# EAGLE design Kenbak-nanoduino_v2_001 (EAGLE 9.3.0)
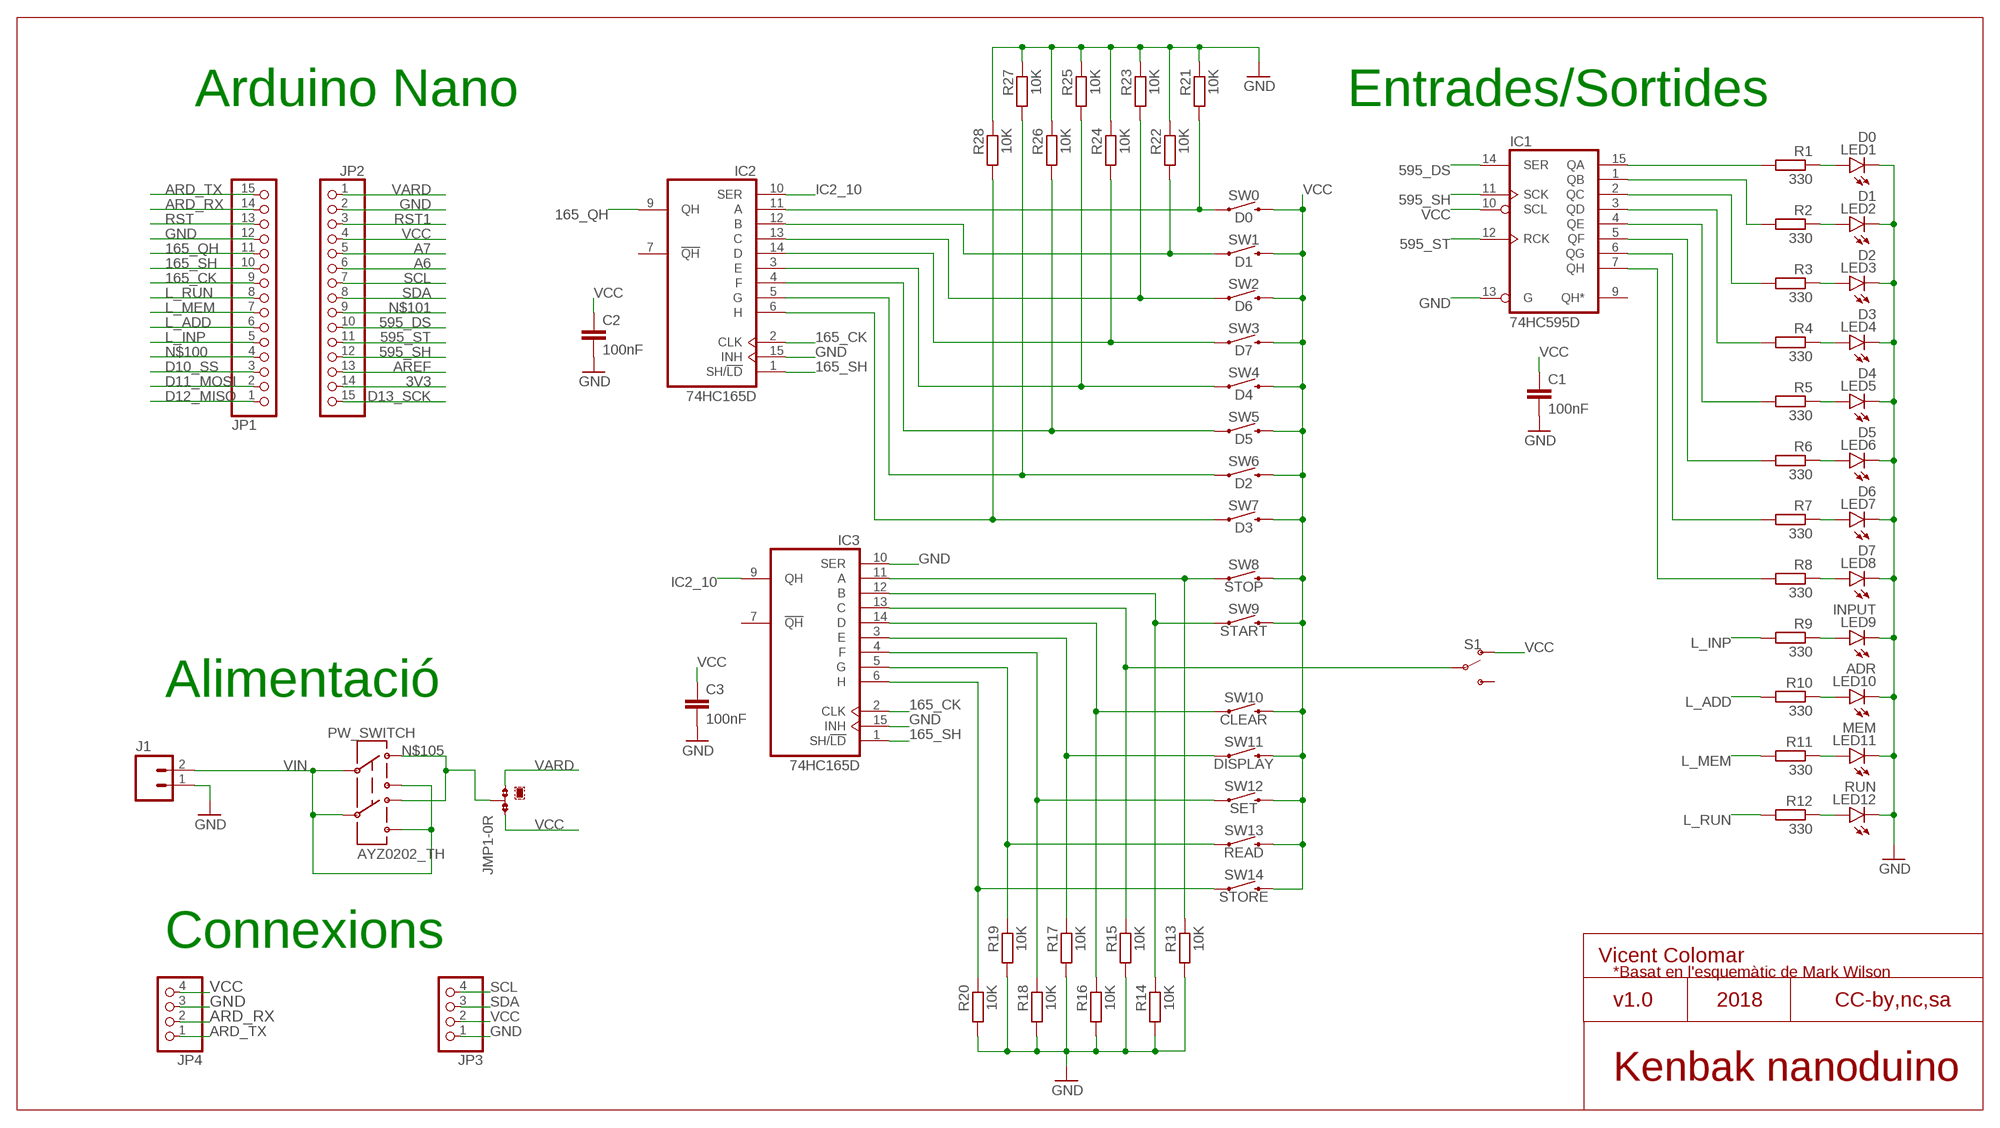
[diagram p0: schematic, sheet 1]

## Parts
C1  100nF  C-EUC1206  [C1206]
C2  100nF  C-EUC1206  [C1206]
C3  100nF  C-EUC1206  [C1206]
IC1  74HC595D  [SO16]
IC2  74HC165D  [SO16]
IC3  74HC165D  [SO16]
J1  M02LOCK_LONGPADS  [1X02_LOCK_LONGPADS]
JMP1  0R-JUMPA  [A0R-JMP]
JP1  PINHD-1X15_2.54-SMD  [1X15SMD]
JP2  PINHD-1X15_2.54-SMD  [1X15SMD]
JP3  PINHD-1X04_2.54-SMD  [1X04SMD]
JP4  PINHD-1X04_2.54-SMD  [1X04SMD]
LED1  D0  LED3MM  [LED3MM]
LED2  D1  LED3MM  [LED3MM]
LED3  D2  LED3MM  [LED3MM]
LED4  D3  LED3MM  [LED3MM]
LED5  D4  LED3MM  [LED3MM]
LED6  D5  LED3MM  [LED3MM]
LED7  D6  LED3MM  [LED3MM]
LED8  D7  LED3MM  [LED3MM]
LED9  INPUT  LED3MM  [LED3MM]
LED10  ADR  LED3MM  [LED3MM]
LED11  MEM  LED3MM  [LED3MM]
LED12  RUN  LED3MM  [LED3MM]
PW_SWITCH  AYZ0202_TH  [AYZ0202_TH]
R1  330  R-EU_R1206  [R1206]
R2  330  R-EU_R1206  [R1206]
R3  330  R-EU_R1206  [R1206]
R4  330  R-EU_R1206  [R1206]
R5  330  R-EU_R1206  [R1206]
R6  330  R-EU_R1206  [R1206]
R7  330  R-EU_R1206  [R1206]
R8  330  R-EU_R1206  [R1206]
R9  330  R-EU_R1206  [R1206]
R10  330  R-EU_R1206  [R1206]
R11  330  R-EU_R1206  [R1206]
R12  330  R-EU_R1206  [R1206]
R13  10K  R-EU_R1206  [R1206]
R14  10K  R-EU_R1206  [R1206]
R15  10K  R-EU_R1206  [R1206]
R16  10K  R-EU_R1206  [R1206]
R17  10K  R-EU_R1206  [R1206]
R18  10K  R-EU_R1206  [R1206]
R19  10K  R-EU_R1206  [R1206]
R20  10K  R-EU_R1206  [R1206]
R21  10K  R-EU_R1206  [R1206]
R22  10K  R-EU_R1206  [R1206]
R23  10K  R-EU_R1206  [R1206]
R24  10K  R-EU_R1206  [R1206]
R25  10K  R-EU_R1206  [R1206]
R26  10K  R-EU_R1206  [R1206]
R27  10K  R-EU_R1206  [R1206]
R28  10K  R-EU_R1206  [R1206]
S1  SWITCH-SPDT-PTH-11.6X4.0MM  [SWITCH_SPDT_PTH_11.6X4.0MM]
SW0  D0  BOTOSMD  [TACTILE_SWITCH_SMD_6.0X3.5MM]
SW1  D1  BOTOSMD  [TACTILE_SWITCH_SMD_6.0X3.5MM]
SW2  D6  BOTOSMD  [TACTILE_SWITCH_SMD_6.0X3.5MM]
SW3  D7  BOTOSMD  [TACTILE_SWITCH_SMD_6.0X3.5MM]
SW4  D4  BOTOSMD  [TACTILE_SWITCH_SMD_6.0X3.5MM]
SW5  D5  BOTOSMD  [TACTILE_SWITCH_SMD_6.0X3.5MM]
SW6  D2  BOTOSMD  [TACTILE_SWITCH_SMD_6.0X3.5MM]
SW7  D3  BOTOSMD  [TACTILE_SWITCH_SMD_6.0X3.5MM]
SW8  STOP  BOTOSMD  [TACTILE_SWITCH_SMD_6.0X3.5MM]
SW9  START  BOTOSMD  [TACTILE_SWITCH_SMD_6.0X3.5MM]
SW10  CLEAR  BOTOSMD  [TACTILE_SWITCH_SMD_6.0X3.5MM]
SW11  DISPLAY  BOTOSMD  [TACTILE_SWITCH_SMD_6.0X3.5MM]
SW12  SET  BOTOSMD  [TACTILE_SWITCH_SMD_6.0X3.5MM]
SW13  READ  BOTOSMD  [TACTILE_SWITCH_SMD_6.0X3.5MM]
SW14  STORE  BOTOSMD  [TACTILE_SWITCH_SMD_6.0X3.5MM]

## Nets
3V3: JP2.14
165_CK: IC2.2(CLK) IC3.2(CLK) JP1.9
165_QH: IC2.9(QH) JP1.11
165_SH: IC2.1(SH/!LD) IC3.1(SH/!LD) JP1.10
595_DS: IC1.14(SER) JP2.10
595_SH: IC1.11(SCK) JP2.12
595_ST: IC1.12(RCK) JP2.11
A6: JP2.6
A7: JP2.5
ARD_RX: JP1.14 JP4.2
ARD_TX: JP1.15 JP4.1
AREF: JP2.13
D10_SS: JP1.3
D11_MOSI: JP1.2
D12_MISO: JP1.1
D13_SCK: JP2.15
GND: C1.2 C2.2 C3.2 IC1.13(G) IC2.15(INH) IC3.10(SER) IC3.15(INH) J1.1 JP1.12 JP2.2 JP3.1 JP4.3 LED1.K(C) LED2.K(C) LED3.K(C) LED4.K(C) LED5.K(C) LED6.K(C) LED7.K(C) LED8.K(C) LED9.K(C) LED10.K(C) LED11.K(C) LED12.K(C) R13.2 R14.2 R15.2 R16.2 R17.2 R18.2 R19.2 R20.2 R21.1 R22.1 R23.1 R24.1 R25.1 R26.1 R27.1 R28.1
IC2_10: IC2.10(SER) IC3.9(QH)
L_ADD: JP1.6 R10.2
L_INP: JP1.5 R9.2
L_MEM: JP1.7 R11.2
L_RUN: JP1.8 R12.2
N$1: LED1.A R1.1
N$2: LED2.A R2.1
N$3: LED3.A R3.1
N$4: LED4.A R4.1
N$5: LED5.A R5.1
N$6: LED6.A R6.1
N$7: LED7.A R7.1
N$8: LED8.A R8.1
N$9: LED9.A R9.1
N$10: LED10.A R10.1
N$11: LED11.A R11.1
N$12: LED12.A R12.1
N$13: IC1.15(QA) R1.2
N$14: IC1.1(QB) R2.2
N$15: IC1.2(QC) R3.2
N$16: IC1.3(QD) R4.2
N$17: IC1.4(QE) R5.2
N$18: IC1.5(QF) R6.2
N$19: IC1.6(QG) R7.2
N$20: IC1.7(QH) R8.2
N$21: IC2.11(A) R21.2 SW0.1
N$22: IC2.12(B) R22.2 SW1.1
N$23: IC2.13(C) R23.2 SW2.1
N$24: IC2.14(D) R24.2 SW3.1
N$25: IC3.13(C) R15.1 S1.2(P)
N$26: IC2.3(E) R25.2 SW4.1
N$27: IC2.4(F) R26.2 SW5.1
N$28: IC2.5(G) R27.2 SW6.1
N$29: IC2.6(H) R28.2 SW7.1
N$30: IC3.11(A) R13.1 SW8.1
N$31: IC3.12(B) R14.1 SW9.1
N$33: IC3.14(D) R16.1 SW10.1
N$34: IC3.3(E) R17.1 SW11.1
N$35: IC3.4(F) R18.1 SW12.1
N$36: IC3.5(G) R19.1 SW13.1
N$37: IC3.6(H) R20.1 SW14.1
N$100: JP1.4
N$101: JP2.9
N$105: JMP1.2 PW_SWITCH.D1 PW_SWITCH.D2
RST: JP1.13
RST1: JP2.3
SCL: JP2.7 JP3.4
SDA: JP2.8 JP3.3
VARD: JMP1.3 JP2.1
VCC: C1.1 C2.1 C3.1 IC1.10(SCL) JMP1.1 JP2.4 JP3.2 JP4.4 S1.1(O) SW0.2 SW1.2 SW2.2 SW3.2 SW4.2 SW5.2 SW6.2 SW7.2 SW8.2 SW9.2 SW10.2 SW11.2 SW12.2 SW13.2 SW14.2
VIN: J1.2 PW_SWITCH.B1 PW_SWITCH.B2 PW_SWITCH.C1 PW_SWITCH.C2
Unconnected: IC1.9(QH*) IC2.7(!QH) IC3.7(!QH) S1.3(S)

## Notes on the sheet
- Arduino Nano | Entrades/Sortides
- Alimentació
- Connexions
- Vicent Colomar
- *Basat en l'esquemàtic de Mark Wilson
- v1.0 | 2018 | CC-by,nc,sa
- Kenbak nanoduino

## Power pins joined to a net without a drawn wire
GND: IC1.8(GND) IC2.8(GND) IC3.8(GND)
VCC: IC1.16(VCC) IC2.16(VCC) IC3.16(VCC)

## Library data of the parts
C1-C3 = rcl:C-EU: CAPACITOR, European symbol; SPICEPREFIX: C
IC1 = 74xx-eu:74*595: 8-bit SHIFT REGISTER, output latch
IC2 IC3 = 74xx-eu:74*165: 8-bit parallel load SHIFT REGISTER
J1 = SparkFun:M02: Header 2 Standard 2-pin 0.1" header. Use with straight break away headers (SKU : PRT-00116), right angle break away headers (PRT-00553), swiss pins (PRT-00743), machine pins (PRT-00117), and female headers (PRT-00115). Molex polarized connector foot print use with SKU : PRT-08233 with associated crimp pins and housings.
JMP1 = jump-0r-smd:0R-JUMP: SMD 0R 0805 Jumper
JP1 JP2 = pinhead-2:PINHD-1X15: PIN HEADER
JP3 JP4 = pinhead-2:PINHD-1X04: PIN HEADER
LED1-LED12 = led:LED: LED OSRAM: - CHIPLED LG R971, LG N971, LY N971, LG Q971, LY Q971, LO R971, LY R971 LH N974, LH R974 LS Q976, LO Q976, LY Q976 LO Q996 - Hyper CHIPLED LW Q18S LB Q993, LB Q99A, LB R99A - SideLED LS A670, LO A670, LY A670, LG A670, LP A670 LB A673, LV A673, LT A673, LW A673 LH A674 LY A675 LS A676, LA A676, LO A676, LY A676, LW A676 LS A679, LY A679, LG A679 - Hyper Micro SIDELED® LS Y876, LA Y876, LO Y876, LY Y876 LT Y87S - SmartLED LW L88C, LW L88S LB L89C, LB L89S, LG L890 LS L89K, LO L89K, LY L89K LS L896, LA L896, LO L896, LY L896 - TOPLED LS T670, LO T670, LY T670, LG T670, LP T670 LSG T670, LSP T670, LSY T670, LOP T670, LYG T670 LG T671, LOG T671, LSG T671 LB T673, LV T673, LT T673, LW T673 LH T674 LS T676, LA T676, LO T676, LY T676, LB T676, LH T676, LSB T676, LW T676 LB T67C, LV T67C, LT T67C, LS T67K, LO T67K, LY T67K, LW E67C LS E67B, LA E67B, LO E67B, LY E67B, LB E67C, LV E67C, LT E67C LW T67C LS T679, LY T679, LG T679 LS T770, LO T770, LY T770, LG T770, LP T770 LB T773, LV T773, LT T773, LW T773 LH T774 LS E675, LA E675, LY E675, LS T675 LS T776, LA T776, LO T776, LY T776, LB T776 LHGB T686 LT T68C, LB T68C - Hyper Mini TOPLED® LB M676 - Mini TOPLED Santana® LG M470 LS M47K, LO M47K, LY M47K Source: http://www.osram.convergy.de LUXEON: - LUMILED® LXK2-PW12-R00, LXK2-PW12-S00, LXK2-PW14-U00, LXK2-PW14-V00 LXK2-PM12-R00, LXK2-PM12-S00, LXK2-PM14-U00 LXK2-PE12-Q00, LXK2-PE12-R00, LXK2-PE12-S00, LXK2-PE14-T00, LXK2-PE14-U00 LXK2-PB12-K00, LXK2-PB12-L00, LXK2-PB12-M00, LXK2-PB14-N00, LXK2-PB14-P00, LXK2-PB14-Q00 LXK2-PR12-L00, LXK2-PR12-M00, LXK2-PR14-Q00, LXK2-PR14-R00 LXK2-PD12-Q00, LXK2-PD12-R00, LXK2-PD12-S00 LXK2-PH12-R00, LXK2-PH12-S00 LXK2-PL12-P00, LXK2-PL12-Q00, LXK2-PL12-R00 Source: www.luxeon.com KINGBRIGHT: KA-3528ASYC Source: www.kingbright.com
PW_SWITCH = 1r_BAT_guissona:AYZ0202_TH
R1-R28 = resistor:R-EU_: RESISTOR, European symbol
S1 = SparkFun-Switches:SWITCH-SPDT: Single Pole, Double Throw (SPDT) Switch Single-pole, double-throw (SPDT) switch. Variant Overview SMD-AYZ0202 Surface Mount DPDT Switch <https://www.sparkfun.com/products/597> (COM-00597) Used on e.g. LilyPad Arduino USB - ATmega32U4 Board <https://www.sparkfun.com/products/12049> PTH-11.6X4.0MM SPDT Mini Power Switch <https://www.sparkfun.com/products/102> (COM-00102) Used on e.g. SparkFun Simon Says - Through-Hole Soldering Kit <https://www.sparkfun.com/products/10547> (KIT-10547) PTH-11.6X4.0MM-KIT KIT version of SPDT Mini Power Switch - Simplifies soldering by removing tStop of switch pins - only one side can be soldered. PTH-11.6X4.0MM-LOCK LOCK version of SPDT Mini Power Switch - Offset pins hold switch in place for easier soldering. SMD-RIGHT-ANGLE Surface Mount Right Angle Switch <https://www.sparkfun.com/products/10860> (COM-10860) Used on e.g. SparkFun ESP8266 Thing <https://www.sparkfun.com/products/13231>; PROD_ID: SWCH-08261; SF_SKU: COM-00102
SW0 SW1-SW14 = dragonet80:BOTO

## Board
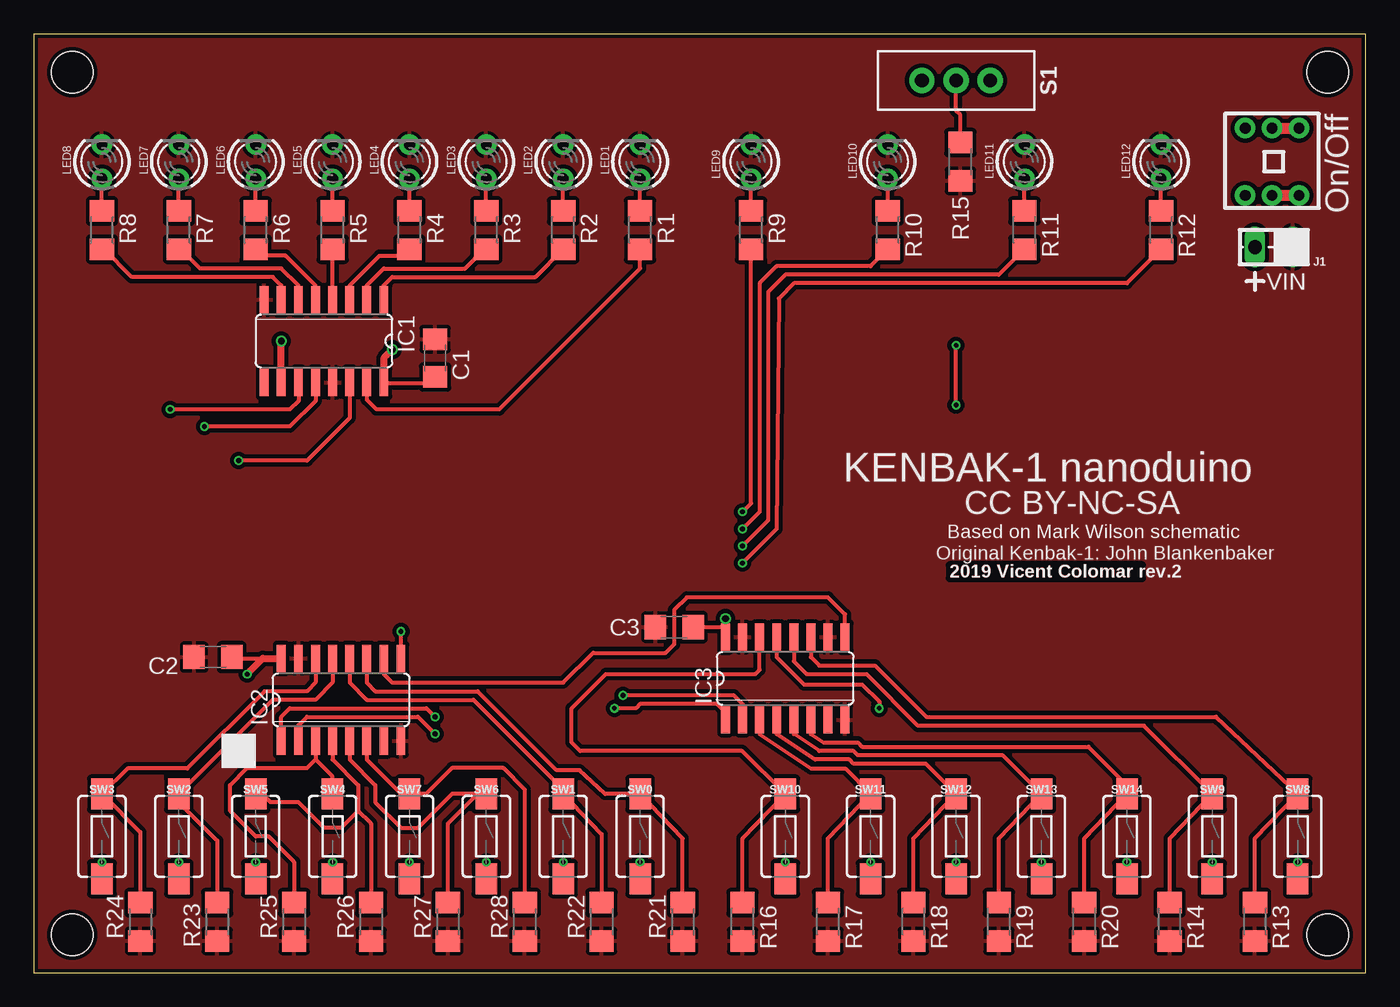
[diagram p1: board, top side]
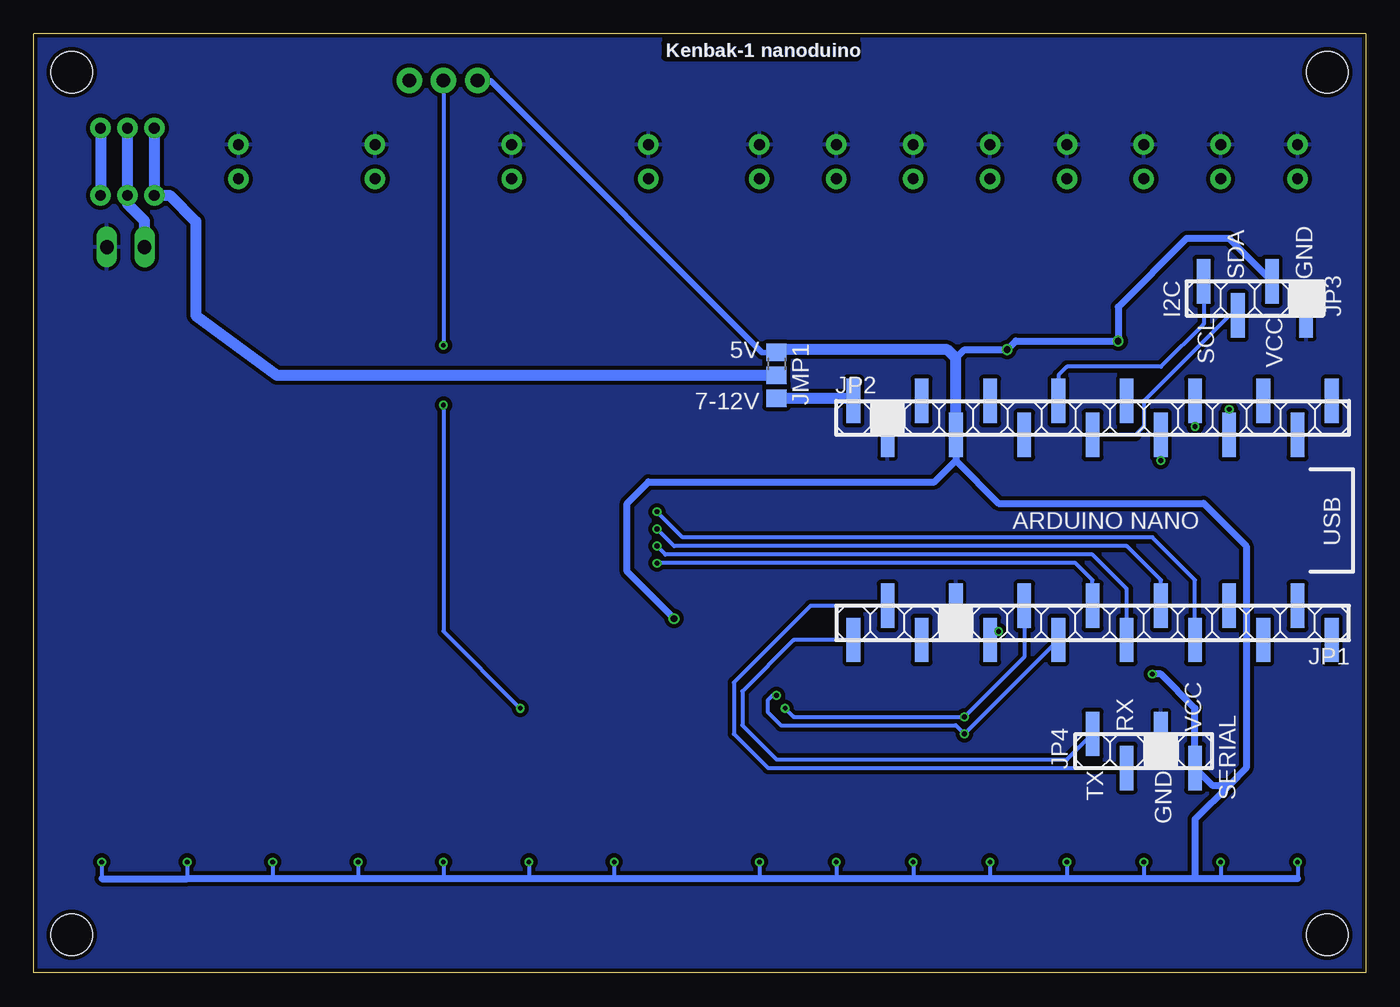
[diagram p2: board, bottom side, seen from below]

Size 99.05 x 69.85 mm. Coordinates in mm from the lower left corner, seen from the top.
Outline: 99.05,69.84 99.05,0 0,0 0,69.84
Outline: 0,69.85 99.05,69.85
Copper layers (1*16): Top 0.035mm / dielectric 1.6mm / Bottom 0.035mm
Design rules "JLPCB_2-layer_PCB_eagle_rule": minimum track width 5mil, minimum drill 0.2mm, track to track 5mil, track to pad 5mil, pad to pad 5mil, via to via 5mil, smd to smd 0mil, copper to edge 0.2mm, drill to drill 11mil, minimum pad ring 3mil, minimum via ring 0.15mm, stop-mask expansion 0mil, vias tented up to drill 100mil, thermal gap 10mil
Holes 3.1 mm at 96.2,66.99 96.2,2.86 2.86,66.99 2.86,2.86

### Footprints (pad centres in the part's own frame; a part is rotated, then mirrored left to right if it is on the bottom)
C1206 = smd 1.6 x 1.8: 1 -1.4,0; 2 1.4,0
SO16 = smd 0.66 x 2.032: 1 -4.445,-3.073; 2 -3.175,-3.073; 3 -1.905,-3.073; 4 -0.635,-3.073; 5 0.635,-3.073; 6 1.905,-3.073; 7 3.175,-3.073; 8 4.445,-3.073; 9 4.445,3.073; 10 3.175,3.073; 11 1.905,3.073; 12 0.635,3.073; 13 -0.635,3.073; 14 -1.905,3.073; 15 -3.175,3.073; 16 -4.445,3.073
1X02_LOCK_LONGPADS = drill 1.016 long: 1 -0.127,0; 2 2.667,0
A0R-JMP = smd 1.5 x 1.3: 1 0,1.7; 2 0,0; 3 0,-1.7
1X15SMD = smd 1.016 x 3.302: 1 -1.27,1.27; 2 1.27,-1.27; 3 3.81,1.27; 4 6.35,-1.27; 5 8.89,1.27; 6 11.43,-1.27; 7 13.97,1.27; 8 16.51,-1.27; 9 19.05,1.27; 10 21.59,-1.27; 11 24.13,1.27; 12 26.67,-1.27; 13 29.21,1.27; 14 31.75,-1.27; 15 34.29,1.27
1X04SMD = smd 1.016 x 3.302: 1 -1.27,1.27; 2 1.27,-1.27; 3 3.81,1.27; 4 6.35,-1.27
LED3MM = drill 0.813 pad 1.524: A -1.27,0; K 1.27,0
AYZ0202_TH = drill 0.8 pad 1.524: B1 -2.5,-2; B2 2.5,-2; C1 -2.5,0; C2 2.5,0; D1 -2.5,2; D2 2.5,2
R1206 = smd 1.6 x 1.803: 1 -1.422,0; 2 1.422,0
SWITCH_SPDT_PTH_11.6X4.0MM = drill 1.016 pad 1.88: 1 0,2.54; 2 0,0; 3 0,-2.54
TACTILE_SWITCH_SMD_6.0X3.5MM = smd 2.3 x 1.6: 1 -3.15,0; 2 3.15,0

### Placement (x,y rotation side)
C1  29.84,45.72 90 top
C2  13.34,23.5 180 top
C3  47.62,25.72 180 top
IC1  21.59,46.99 180 top
IC2  22.86,20.32 0 top
IC3  55.88,21.91 0 top
J1  93.47,53.98 180 top
JMP1  43.81,44.45 0 bottom
JP1  3.81,26.04 180 bottom
JP2  36.83,41.27 0 bottom
JP3  5.71,50.16 180 bottom
JP4  19.05,16.51 0 bottom
LED1  45.09,60.33 90 top
LED2  39.37,60.33 90 top
LED3  33.66,60.33 90 top
LED4  27.94,60.33 90 top
LED5  22.23,60.33 90 top
LED6  16.51,60.33 90 top
LED7  10.79,60.33 90 top
LED8  5.08,60.33 90 top
LED9  53.34,60.33 90 top
LED10  63.5,60.33 90 top
LED11  73.66,60.33 90 top
LED12  83.82,60.33 90 top
PW_SWITCH  92.08,60.33 90 top
R1  45.09,55.24 270 top
R2  39.37,55.24 270 top
R3  33.66,55.24 270 top
R4  27.94,55.24 270 top
R5  22.23,55.24 270 top
R6  16.51,55.24 270 top
R7  10.79,55.24 270 top
R8  5.08,55.24 270 top
R9  53.34,55.24 270 top
R10  63.5,55.24 270 top
R11  73.66,55.24 270 top
R12  83.82,55.24 270 top
R13  90.81,3.81 270 top
R14  84.45,3.81 270 top
R15  68.9,60.33 270 top
R16  52.7,3.81 270 top
R17  59.05,3.81 270 top
R18  65.41,3.81 270 top
R19  71.75,3.81 270 top
R20  78.11,3.81 270 top
R21  48.26,3.81 90 top
R22  42.23,3.81 90 top
R23  13.65,3.81 90 top
R24  7.94,3.81 90 top
R25  19.37,3.81 90 top
R26  25.08,3.81 90 top
R27  30.8,3.81 90 top
R28  36.51,3.81 90 top
S1  68.58,66.36 90 top
SW0  45.09,10.16 270 top
SW1  39.37,10.16 270 top
SW2  10.79,10.16 270 top
SW3  5.08,10.16 270 top
SW4  22.23,10.16 270 top
SW5  16.51,10.16 270 top
SW6  33.66,10.16 270 top
SW7  27.94,10.16 270 top
SW8  93.98,10.16 270 top
SW9  87.63,10.16 270 top
SW10  55.88,10.16 270 top
SW11  62.23,10.16 270 top
SW12  68.58,10.16 270 top
SW13  74.93,10.16 270 top
SW14  81.28,10.16 270 top

### Tracks (layer width: path | path; a pad name or v marks a point on that pad's centre or on a via)
165_CK  (via drill 0.35)
  Top 0.305: IC3.2 52.7,20 52.07,20.64 v43.81,20.64 | IC2.2 19.68,18.41 20.32,19.05 28.57,19.05 v29.84,17.78
  Bottom 0.305: v43.81,20.64 44.13,20.64 44.45,20.32 44.45,19.37 43.5,18.41 30.48,18.41 v29.84,17.78 JP1.9
165_QH  (via drill 0.35)
  Top 0.305: IC2.9 v27.3,25.4
  Bottom 0.305: v27.3,25.4 JP1.11
165_SH  (via drill 0.35)
  Top 0.305: IC3.1 51.44,19.37 50.8,20 45.09,20 44.77,19.68 v43.18,19.68 | IC2.1 18.41,19.05 19.05,19.68 29.21,19.68 v29.84,19.05
  Bottom 0.305: v43.18,19.68 42.55,19.05 v29.84,19.05 25.4,23.5 JP1.10
595_DS  (via drill 0.35)
  Top 0.305: IC1.14 23.5,41.27 20.32,38.1 v15.24,38.1
  Bottom 0.305: v15.24,38.1 JP2.10
595_SH  (via drill 0.35)
  Top 0.305: IC1.11 19.68,42.55 19.05,41.91 v10.16,41.91
  Bottom 0.305: v10.16,41.91 JP2.12
595_ST  (via drill 0.35)
  Top 0.305: IC1.12 20.95,42.55 19.05,40.64 v12.7,40.64
  Bottom 0.305: v12.7,40.64 JP2.11
ARD_RX
  Bottom 0.305: JP1.14 41.27,27.3 46.99,21.59 46.99,17.78 44.45,15.24 JP4.2
ARD_TX
  Bottom 0.305: JP1.15 42.55,24.77 46.35,20.95 46.35,18.41 43.81,15.88 22.23,15.88 JP4.1
GND
  pour Bottom (isolate 0.305): 0,0 99.06,0 99.06,69.85 0,69.85
  pour Top (isolate 0.305): 0,0 99.06,0 99.06,69.85 0,69.85
IC2_10
  Top 0.305: IC2.10 26.04,22.23 26.67,21.59 39.37,21.59 41.59,23.81 46.98,23.81 47.61,24.45 47.61,26.99 48.57,27.94 59.05,27.94 60.33,26.67 IC3.9
L_ADD  (via drill 0.35)
  Top 0.305: R10.2 62.23,52.55 55.24,52.55 53.98,51.28 53.98,34.29 v52.7,33.02
  Bottom 0.305: JP1.6 15.24,29.21 17.78,31.75 51.44,31.75 v52.7,33.02
L_INP  (via drill 0.35)
  Top 0.305: v52.7,34.29 53.34,34.92 R9.2
  Bottom 0.305: JP1.5 12.7,29.21 15.88,32.38 50.8,32.38 v52.7,34.29
L_MEM  (via drill 0.35)
  Top 0.305: v52.7,31.75 54.61,33.66 54.61,50.65 55.88,51.92 71.75,51.92 R11.2
  Bottom 0.305: JP1.7 17.78,28.57 20.32,31.11 52.07,31.11 v52.7,31.75
L_RUN  (via drill 0.35)
  Top 0.305: v52.7,30.48 55.24,33.02 55.4,50.16 56.52,51.28 81.28,51.28 R12.2
  Bottom 0.305: JP1.8 20.32,29.21 21.59,30.48 v52.7,30.48
N$1
  Top 0.305: R1.1 LED1.A
N$2
  Top 0.305: R2.1 LED2.A
N$3
  Top 0.305: R3.1 LED3.A
N$4
  Top 0.305: R4.1 LED4.A
N$5
  Top 0.305: R5.1 LED5.A
N$6
  Top 0.305: R6.1 LED6.A
N$7
  Top 0.305: R7.1 LED7.A
N$8
  Top 0.305: R8.1 LED8.A
N$9
  Top 0.305: R9.1 LED9.A
N$10
  Top 0.305: R10.1 LED10.A
N$11
  Top 0.305: R11.1 LED11.A
N$12
  Top 0.305: R12.1 LED12.A
N$13
  Top 0.305: R1.2 45.09,52.39 34.61,41.91 25.5,41.91 24.77,42.65 IC1.15
N$14
  Top 0.305: IC1.1 26.04,51.12 26.67,51.75 37.3,51.75 R2.2
N$15
  Top 0.305: IC1.2 24.77,51.12 26.04,52.39 32.07,52.39 33.5,53.82 R3.2
N$16
  Top 0.305: IC1.3 23.5,51.12 25.72,53.34 27.46,53.34 R4.2
N$17
  Top 0.305: IC1.4 R5.2
N$18
  Top 0.305: IC1.5 20.95,51.12 18.73,53.34 16.99,53.34 R6.2
N$19
  Top 0.305: IC1.6 19.68,51.12 18.41,52.39 12.38,52.39 10.95,53.82 R7.2
N$20
  Top 0.305: IC1.7 18.41,51.12 17.78,51.75 7.3,51.75 5.23,53.82 R8.2
N$21
  Top 0.305: IC2.11 24.77,21.59 25.4,20.95 33.02,20.95 38.89,15.08 40.59,15.08 42.5,13.31 SW0.1 48.26,10 R21.2
N$22
  Top 0.305: IC2.12 23.5,21.59 24.77,20.32 32.7,20.32 39.37,13.65 SW1.1 42.23,10.32 R22.2
N$23
  Top 0.305: IC2.13 22.23,21.59 20.95,20.32 17.78,20.32 10.79,13.34 SW2.1 10.79,12.7 13.65,9.84 R23.2
N$24
  Top 0.305: IC2.14 20.95,21.59 20.32,20.95 17.17,20.95 11.43,15.21 6.99,15.21 SW3.1 5.24,13.18 7.94,10.48 R24.2
N$25  (via drill 0.35)
  Top 0.305: IC3.13 55.24,23.5 57.29,21.45 61.59,21.45 62.87,20.18 v62.87,19.68 | v68.58,42.23 v68.58,46.67 | R15.1 68.9,63.82 68.58,64.14 S1.2
  Bottom 0.305: v62.87,19.68 68.58,25.4 v68.58,42.23 | S1.2 v68.58,46.67
N$26
  Top 0.305: IC2.3 20.95,15.88 | 20.95,15.88 22.23,14.61 SW4.1 | R25.2 19.37,8.26 17.46,10.16 16.51,10.16 14.61,12.06 14.61,13.97 15.88,15.24 20.32,15.24 20.95,15.88
N$27
  Top 0.305: IC2.4 22.23,15.88 24.13,13.97 24.13,12.06 | 24.13,12.06 22.86,10.79 21.59,10.79 19.68,12.7 17.62,12.7 17.14,13.18 SW5.1 | R26.2 25.08,11.11 24.13,12.06
N$28
  Top 0.305: IC2.5 23.5,15.88 25.4,13.97 25.4,12.7 27.3,10.79 28.57,10.79 31.11,13.34 33.02,13.34 | SW6.1 33.63,13.34 33.02,13.34 | 33.02,13.34 30.8,11.11 R27.2
N$29
  Top 0.305: IC2.6 24.77,15.88 27.46,13.18 SW7.1 29.18,13.31 31.11,15.24 34.92,15.24 36.51,13.65 R28.2
N$30
  Top 0.305: IC3.11 57.78,23.5 58.42,22.86 62.55,22.86 66.36,19.05 87.89,19.05 SW8.1 90.81,10 R13.1
N$31
  Top 0.305: IC3.12 56.52,23.18 57.47,22.23 61.91,22.23 65.75,18.39 82.55,18.39 SW9.1 84.45,10 R14.1
N$33
  Top 0.305: R16.1 52.7,10 SW10.1 52.68,16.51 40.64,16.51 40.01,17.14 40.01,19.68 42.55,22.23 53.66,22.23 53.98,22.54 IC3.14
N$34
  Top 0.305: IC3.3 53.98,17.78 57.81,15.21 60.35,15.21 62.23,13.34 SW11.1 59.05,10 R17.1
N$35
  Top 0.305: R18.1 65.41,10 SW12.1 66.33,15.56 60.96,15.56 60.64,15.88 58.1,15.88 55.24,17.78 IC3.4
N$36
  Top 0.305: IC3.5 56.52,17.78 58.42,16.51 60.96,16.51 61.27,16.2 72.07,16.17 SW13.1 71.75,10 R19.1
N$37
  Top 0.305: IC3.6 57.78,17.78 58.74,17.14 61.28,17.14 61.59,16.83 78.42,16.83 81.28,13.97 SW14.1 78.11,10 R20.1
N$105
  Bottom 0.813: PW_SWITCH.D2 PW_SWITCH.D1 88.94,57.83 87,55.88 87,48.9 80.96,44.45 JMP1.2
SCL
  Bottom 0.305: JP3.4 12.06,48.26 15.24,45.09 22.23,45.09 22.86,44.45 JP2.7
SDA
  Bottom 0.305: JP3.3 10.16,48.9 16.51,42.55 16.51,40.64 17.14,40.01 JP2.8
VARD
  Bottom 0.813: JMP1.3 38.3,42.75 JP2.1
VCC  (via drill 0.35, 0.5)
  Top 0.305: C3.1 51.44,25.72 IC3.16 | C1.1 29.34,43.81 26.14,43.81 IC1.16 | C2.1 14.84,23.39 IC2.16 | SW3.2 v5.08,8.26 | SW2.2 v10.79,8.26 | SW5.2 v16.51,8.26 | SW4.2 v22.23,8.26 | SW7.2 v27.94,8.26 | SW6.2 v33.66,8.26 | SW1.2 v39.37,8.26 | SW0.2 v45.09,8.26 | SW10.2 v55.88,8.26 | SW11.2 v62.23,8.26 | SW12.2 v68.58,8.26 | SW13.2 v74.93,8.26 | SW14.2 v81.28,8.26 | SW9.2 v87.63,8.26 | SW8.2 v93.98,8.26
  Top 0.508: v51.44,26.35 IC3.16 | v26.67,46.35 26.04,45.72 IC1.16 | IC1.10 v18.41,46.99 | v15.88,22.23 17.04,23.39 IC2.16
  Bottom 0.305: v5.08,8.26 SW3.2 | v10.79,8.26 SW2.2 | v16.51,8.26 SW5.2 | v22.23,8.26 SW4.2 | v27.94,8.26 SW7.2 | v33.66,8.26 SW6.2 | v39.37,8.26 SW1.2 | v45.09,8.26 SW0.2 | v55.88,8.26 SW10.2 | v62.23,8.26 SW11.2 | v68.58,8.26 SW12.2 | v74.93,8.26 SW13.2 | v81.28,8.26 SW14.2 | v87.63,8.26 SW9.2 | v93.98,8.26 SW8.2
  Bottom 0.406: S1.1 65.09,66.36 44.88,46.15 JMP1.1
  Bottom 0.508: SW3.2 SW2.2 12.7,7.01 | 12.7,7.01 SW5.2 SW4.2 SW7.2 SW6.2 SW1.2 SW0.2 SW10.2 SW11.2 SW12.2 SW13.2 SW14.2 SW9.2 SW8.2 | JP2.4 30.48,38.1 | 10.16,13.97 8.89,15.24 8.89,31.75 12.06,34.92 27.3,34.92 30.48,38.1 | 10.16,13.97 12.7,11.43 12.7,7.01 | 10.16,13.97 11.43,13.97 JP4.4 12.7,19.68 15.24,22.23 v15.88,22.23 | 30.48,45.72 29.84,46.35 v26.67,46.35 26.04,46.99 v18.41,46.99 18.41,49.53 13.34,54.61 10.16,54.61 JP3.2 | 43.61,46.35 JMP1.1 | v51.44,26.35 54.93,29.84 54.93,34.92 53.34,36.51 32.07,36.51 30.48,38.1
  Bottom 0.813: JP2.4 30.48,45.72 31.11,46.35 43.61,46.35
VIN
  Top 0.813: PW_SWITCH.C1 PW_SWITCH.B1 | PW_SWITCH.C2 PW_SWITCH.B2
  Bottom 0.813: J1.2 90.81,55.92 92.08,57.19 PW_SWITCH.C1 PW_SWITCH.C2 | PW_SWITCH.B2 PW_SWITCH.B1

### Text on the board
Top: 2019 Vicent Colomar
Bottom: Kenbak-1 nanoduino
tPlace: 2019 Vicent Colomar rev.2
bPlace: Kenbak-1 nanoduino
_tsilk: On/Off | VIN | KENBAK-1 nanoduino | CC BY-NC-SA | Based on Mark Wilson schematic | Original Kenbak-1: John Blankenbaker
_bsilk: GND | SDA | VCC | SCL | I2C | 5V | 7-12V | ARDUINO NANO | USB | SERIAL | VCC | RX | GND | TX